# Altium schematic sheet DASH_MICROCONTROLLER.SchDoc
size A
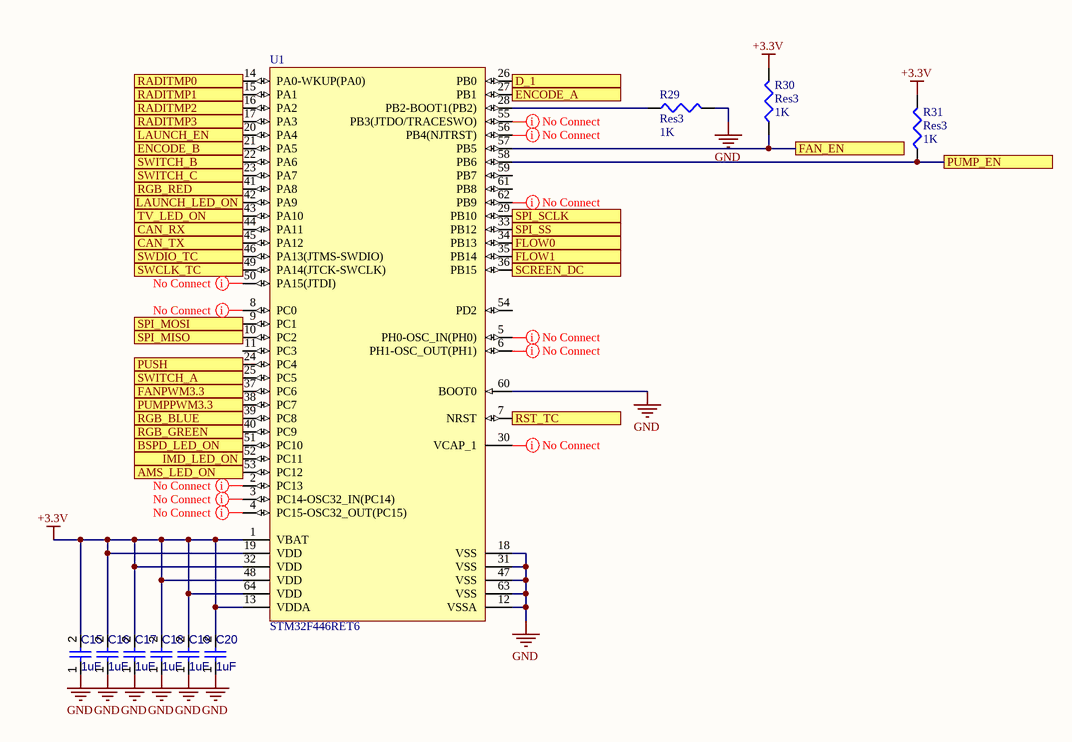
[diagram p0: DASH_MICROCONTROLLER.SchDoc]

## Parts
C15  1uF  [CAPC0603(1608)100_L]
C16  1uF  [CAPC0603(1608)100_L]
C17  1uF  [CAPC0603(1608)100_L]
C18  1uF  [CAPC0603(1608)100_L]
C19  1uF  [CAPC0603(1608)100_L]
C20  1uF  [CAPC0603(1608)100_L]
R29  Res3  value 1K  [J1-0603]
R30  Res3  value 1K  [J1-0603]
R31  Res3  value 1K  [J1-0603]
U1  STM32F446RET6  [STM-LQFP64_L]

## Ports
AMS_LED_ON, BSPD_LED_ON, CAN_RX, CAN_TX, D_1, ENCODE_A, ENCODE_B, FAN_EN, FANPWM3.3, FLOW0, FLOW1, IMD_LED_ON, LAUNCH_EN, LAUNCH_LED_ON, PUMP_EN, PUMPPWM3.3, PUSH, RADITMP0, RADITMP1, RADITMP2, RADITMP3, RGB_BLUE, RGB_GREEN, RGB_RED, RST_TC, SCREEN_DC, SPI_MISO, SPI_MOSI, SPI_SCLK, SPI_SS, SWCLK_TC, SWDIO_TC, SWITCH_A, SWITCH_B, SWITCH_C, TV_LED_ON

## Nets
+3.3V: C15.2 C16.2 C17.2 C18.2 C19.2 C20.2 R30.2 R31.2 U1.1(VBAT) U1.13(VDDA) U1.19(VDD) U1.32(VDD) U1.48(VDD) U1.64(VDD)
GND: C15.1 C16.1 C17.1 C18.1 C19.1 C20.1 R29.2 U1.12(VSSA) U1.18(VSS) U1.31(VSS) U1.47(VSS) U1.60(BOOT0) U1.63(VSS)
AMS_LED_ON: U1.53(PC12) ; port AMS_LED_ON
BSPD_LED_ON: U1.51(PC10) ; port BSPD_LED_ON
CAN_RX: U1.44(PA11) ; port CAN_RX
CAN_TX: U1.45(PA12) ; port CAN_TX
D_1: U1.26(PB0) ; port D_1
ENCODE_A: U1.27(PB1) ; port ENCODE_A
ENCODE_B: U1.21(PA5) ; port ENCODE_B
FAN_EN: R30.1 U1.57(PB5) ; port FAN_EN
FANPWM3.3: U1.37(PC6) ; port FANPWM3.3
FLOW0: U1.34(PB13) ; port FLOW0
FLOW1: U1.35(PB14) ; port FLOW1
IMD_LED_ON: U1.52(PC11) ; port IMD_LED_ON
LAUNCH_EN: U1.20(PA4) ; port LAUNCH_EN
LAUNCH_LED_ON: U1.42(PA9) ; port LAUNCH_LED_ON
PUMP_EN: R31.1 U1.58(PB6) ; port PUMP_EN
PUMPPWM3.3: U1.38(PC7) ; port PUMPPWM3.3
PUSH: U1.24(PC4) ; port PUSH
RADITMP0: U1.14(PA0-WKUP(PA0)) ; port RADITMP0
RADITMP1: U1.15(PA1) ; port RADITMP1
RADITMP2: U1.16(PA2) ; port RADITMP2
RADITMP3: U1.17(PA3) ; port RADITMP3
RGB_BLUE: U1.39(PC8) ; port RGB_BLUE
RGB_GREEN: U1.40(PC9) ; port RGB_GREEN
RGB_RED: U1.41(PA8) ; port RGB_RED
RST_TC: U1.7(NRST) ; port RST_TC
SCREEN_DC: U1.36(PB15) ; port SCREEN_DC
SPI_MISO: U1.10(PC2) ; port SPI_MISO
SPI_MOSI: U1.9(PC1) ; port SPI_MOSI
SPI_SCLK: U1.29(PB10) ; port SPI_SCLK
SPI_SS: U1.33(PB12) ; port SPI_SS
SWCLK_TC: U1.49(PA14(JTCK-SWCLK)) ; port SWCLK_TC
SWDIO_TC: U1.46(PA13(JTMS-SWDIO)) ; port SWDIO_TC
SWITCH_A: U1.25(PC5) ; port SWITCH_A
SWITCH_B: U1.22(PA6) ; port SWITCH_B
SWITCH_C: U1.23(PA7) ; port SWITCH_C
TV_LED_ON: U1.43(PA10) ; port TV_LED_ON
NetR29_1: R29.1 U1.28(PB2-BOOT1(PB2))

Not connected (* = marked no-connect by the designer): U1 2(PC13) 3(PC14-OSC32_IN(PC14)) 4(PC15-OSC32_OUT(PC15)) 5(PH0-OSC_IN(PH0)) 6(PH1-OSC_OUT(PH1)) 8(PC0) 11(PC3) 30(VCAP_1) 50(PA15(JTDI)) 54(PD2) 55(PB3(JTDO/TRACESWO)) 56(PB4(NJTRST)) 59(PB7) 61(PB8) 62(PB9)

## Layout directives
mark named No Connect: NetU1_2, NetU1_3, NetU1_4, NetU1_5, NetU1_6, NetU1_8, NetU1_30, NetU1_50, NetU1_55, NetU1_56, NetU1_62

## Library data of the parts
C15-C20 = CMP-005-000568-1: Chip Capacitor, 1 uF, +/- 10%, 6.3 V, 0402 (1005 Metric); Available Preview Images: 2D; Design Item ID: CMP-001-00008-4; Source: Integrated_Library - 12.03.21 - 15.39.SchLib
R29-R31 = Res3: Resistor; Published: 8-Jun-2000; LatestRevisionDate: 29-May-2009; LatestRevisionNote: IPC-7351 Footprint Added.; PackageReference: J1-0603; Publisher: Altium Limited; PackageDescription: Chip Resistor
U1 = CMP-0243-00218-1: ARM Cortex-M4 32-bit MCU+FPU, 512 KB Flash, 128 KB Internal RAM, 50 I/Os, 64-Pin LQFP, -40 to 85 degC, Tray; I/Os (High Current): 50; Supply Voltage(Vcc) min (V): 1.7; Operating Frequency(F) (Processor speed) (MHz): 180; D/A Converter: 2; Internal RAM Size (kB): 128; FLASH Size (Prog) (kB): 512; Core: ARM Cortex-M4; ComponentLink1Description: Manufacturer URL; Package Reference: 64-Pin Low-profile Quad Flat Package, Body 10 x 10 mm, Pitch 0.5 mm; ComponentLink2URL: http://www.st.com/st-web-ui/static/active/en/resource/technical/document/datasheet/DM00141306.pdf; Packing: Tray; DatasheetVersion: Rev. 6; ComponentLink1URL: http://www.st.com/; ComponentLink2Description: Datasheet; Package Description: LQFP64; Mounting Technology: Surface Mount